# EAGLE design NinjaScanLight (EAGLE 4.16)
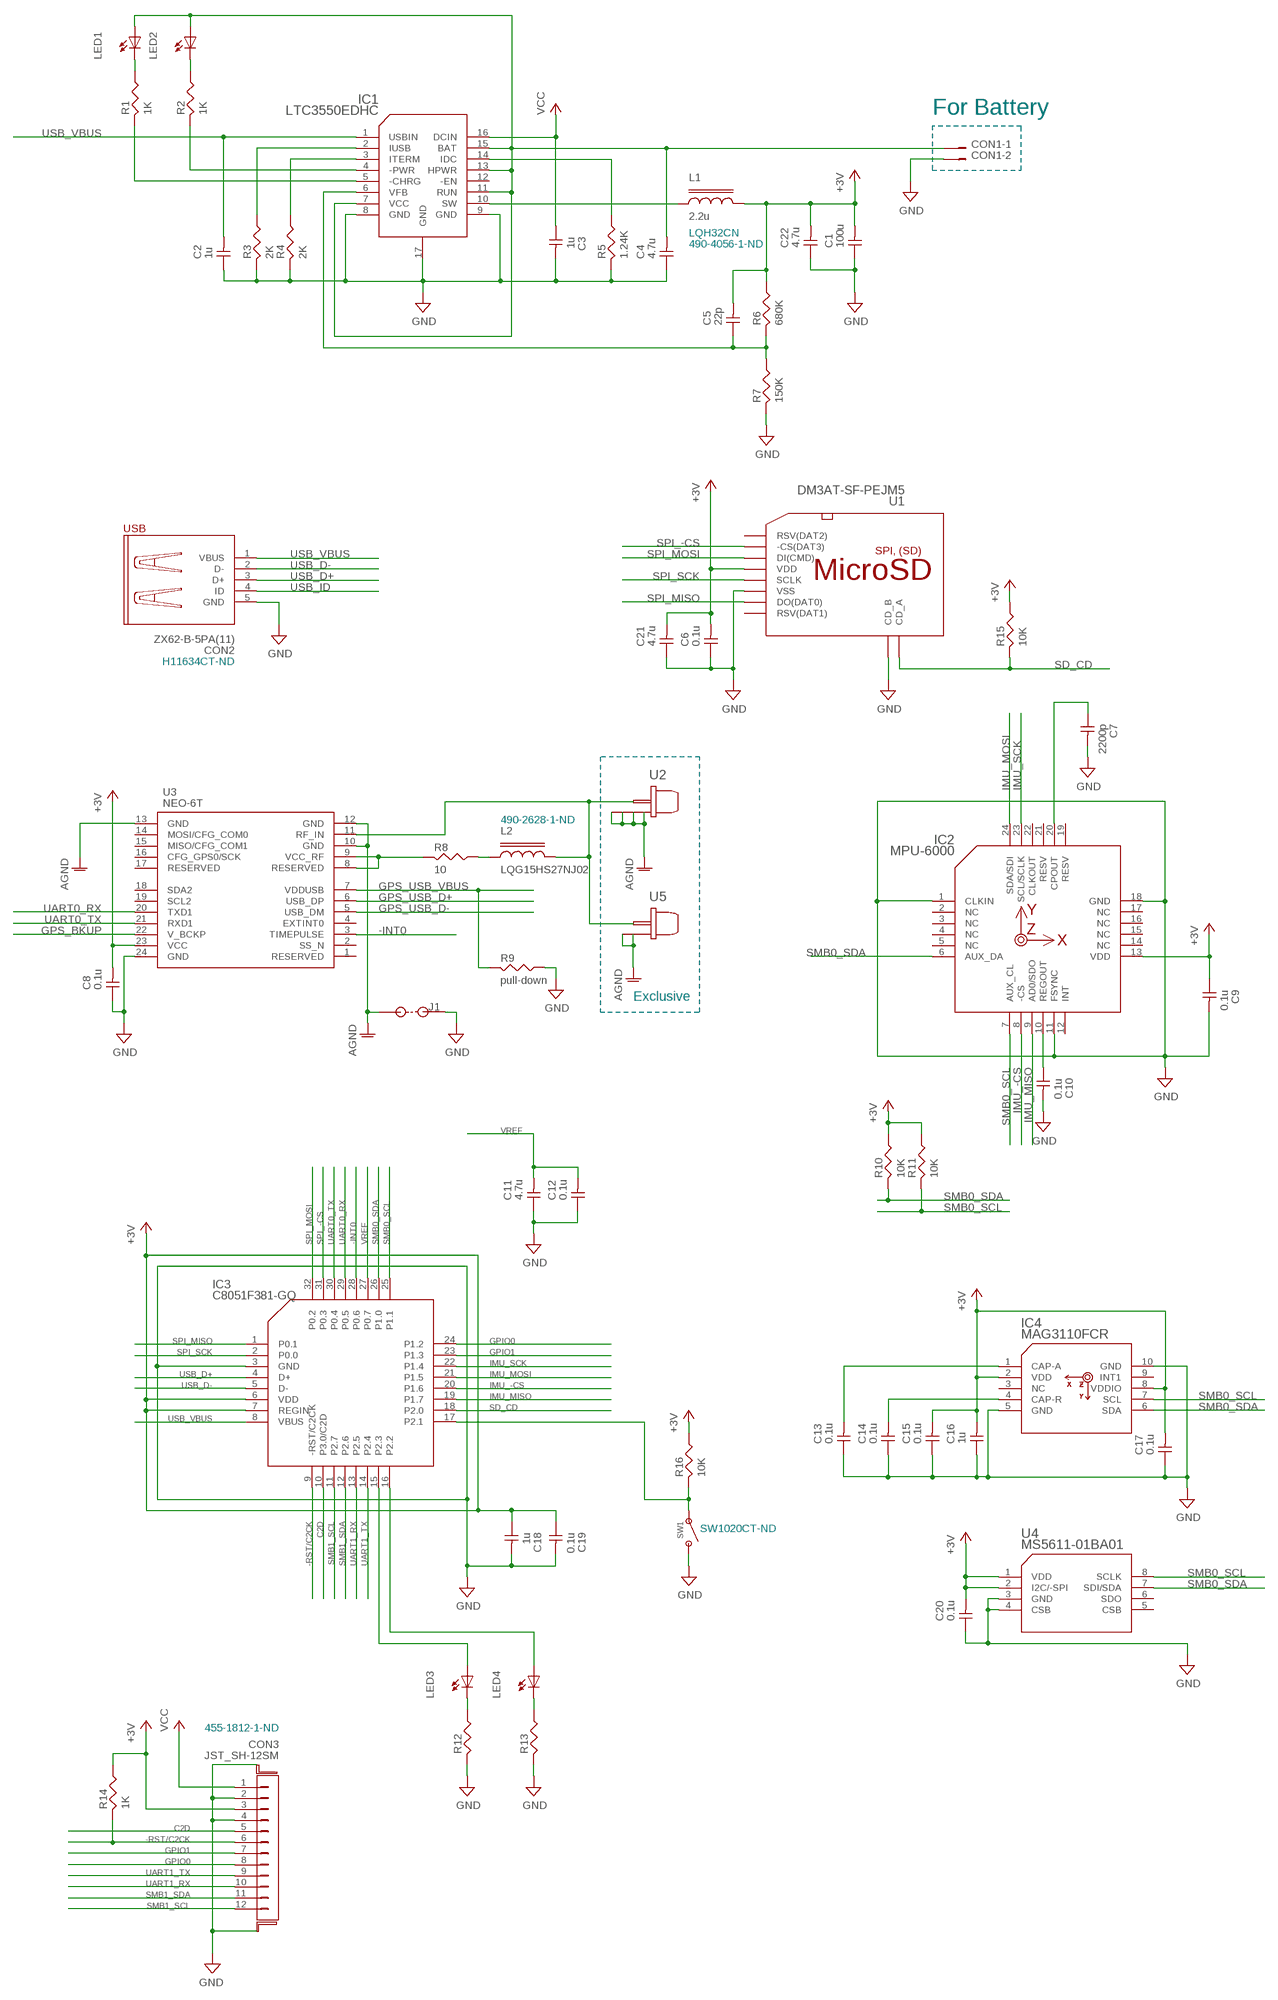
[diagram p0: schematic, sheet 1]

## Parts
C1  100u  C3216  [3216]
C2  1u  C1005  [1005]
C3  1u  C1005  [1005]
C4  4.7u  C1608  [1608]
C5  22p  C1005  [1005]
C6  0.1u  C1005  [1005]
C7  2200p  C1005  [1005]
C8  0.1u  C1005  [1005]
C9  0.1u  C1005  [1005]
C10  0.1u  C1005  [1005]
C11  4.7u  C1608  [1608]
C12  0.1u  C1005  [1005]
C13  0.1u  C1005  [1005]
C14  0.1u  C1005  [1005]
C15  0.1u  C1005  [1005]
C16  1u  C1005  [1005]
C17  0.1u  C1005  [1005]
C18  1u  C1005  [1005]
C19  0.1u  C1005  [1005]
C20  0.1u  C1005  [1005]
C21  4.7u  C1608  [1608]
C22  4.7u  C1608  [1608]
CON1  JST_ZH-2B(MM)  [JST_ZH-2B(MM)]
CON2  ZX62-B-5PA(11)  ZX62-AB-5PA  [ZX62-AB-5PA]
CON3  JST_SH-12SM  [JST_SH-SM12B]
IC1  LTC3550EDHC  [DFN16BP]
IC2  MPU-6000  [QFN24]
IC3  C8051F381-GQ  C8051F342_32  [LQFP32]
IC4  MAG3110FCR  [DFN10]
J1  JUMPER1608  [1608]
L1  2.2u  L3225  [3225]
L2  LQG15HS27NJ02  L1005  [1005]
LED1  LED1608  [1608D]
LED2  LED1608  [1608D]
LED3  LED1608  [1608D]
LED4  LED1608  [1608D]
R1  1K  R1005  [1005]
R2  1K  R1005  [1005]
R3  2K  R1005  [1005]
R4  2K  R1005  [1005]
R5  1.24K  R1005  [1005]
R6  680K  R1005  [1005]
R7  150K  R1005  [1005]
R8  10  R1005  [1005]
R9  pull-down  R1005  [1005]
R10  10K  R1005  [1005]
R11  10K  R1005  [1005]
R12  R1005  [1005]
R13  R1005  [1005]
R14  1K  R1005  [1005]
R15  10K  R1005  [1005]
R16  10K  R1005  [1005]
SW1  B3U-1000P  [B3U-1000P]
U1  DM3AT-SF-PEJM5  DM3A-SF-PEJ2  [DM3]
U2  H.FL  [H.FL]
U3  NEO-6T  [NEO]
U4  MS5611-01BA01  [LGA8]
U5  U.FL  [U.FL]

## Nets
+3V: C1.2 C5.P$2 C6.P$2 C8.P$2 C9.P$1 C15.P$2 C16.P$2 C17.P$2 C18.P$1 C19.P$1 C20.P$2 C21.P$2 C22.P$2 CON3.3 IC2.13(VDD) IC3.6(VDD) IC3.7(REGIN) IC4.2(VDD) IC4.8(VDDIO) L1.2 R6.P$1 R10.P$1 R11.P$1 R14.P$1 R15.P$1 R16.P$1 U1.4(VDD) U3.23(VCC) U4.1(VDD) U4.2(I2C/-SPI)
-INT0: IC3.28(P0.6) U3.3(TIMEPULSE)
-RST/C2CK: CON3.6 IC3.9(-RST/C2CK) R14.P$2
AGND: J1.P$1 U2.GND@1(GND) U2.GND@2(GND) U2.GND@3(GND) U3.10(GND) U3.12(GND) U3.13(GND) U5.GND@1(GND) U5.GND@2(GND)
C2D: CON3.5 IC3.10(P3.0/C2D)
GND: C1.1 C2.P$1 C3.P$2 C4.P$1 C6.P$1 C7.P$2 C8.P$1 C9.P$2 C10.P$2 C11.P$1 C12.P$1 C13.P$1 C14.P$1 C15.P$1 C16.P$1 C17.P$1 C18.P$2 C19.P$2 C20.P$1 C21.P$1 C22.P$1 CON1.2 CON2.5(GND) CON3.2 CON3.4 CON3.GUIDE@L(GUIDE) CON3.GUIDE@R(GUIDE) IC1.8(GND) IC1.9(GND) IC1.17(GND) IC2.1(CLKIN) IC2.11(FSYNC) IC2.18(GND) IC3.3(GND) IC4.5(GND) IC4.10(GND) J1.P$2 R3.P$2 R4.P$2 R5.P$2 R7.P$2 R9.P$1 R12.P$2 R13.P$2 SW1.2 U1.6(VSS) U1.CD_B U3.24(GND) U4.3(GND) U4.4(CSB)
GPIO0: CON3.8 IC3.24(P1.2)
GPIO1: CON3.7 IC3.23(P1.3)
GPS_BKUP: U3.22(V_BCKP)
GPS_USB_D+: U3.6(USB_DP)
GPS_USB_D-: U3.5(USB_DM)
GPS_USB_VBUS: R9.P$2 U3.7(VDDUSB)
IMU_-CS: IC2.8(-CS) IC3.20(P1.6)
IMU_MISO: IC2.9(AD0/SDO) IC3.19(P1.7)
IMU_MOSI: IC2.24(SDA/SDI) IC3.21(P1.5)
IMU_SCK: IC2.23(SCL/SCLK) IC3.22(P1.4)
N$1: C10.P$1 IC2.10(REGOUT)
N$2: LED3.K R12.P$1
N$3: C7.P$1 IC2.20(CPOUT)
N$4: IC3.15(P2.3) LED3.A
N$5: IC3.16(P2.2) LED4.A
N$6: L2.P$1 R8.P$1
N$7: L2.P$2 U2.SIG(C) U3.11(RF_IN) U5.SIG(C)
N$8: R8.P$2 U3.8(RESERVED) U3.9(VCC_RF)
N$9: LED1.K R1.P$1
N$10: IC3.17(P2.1) R16.P$2 SW1.1
N$11: LED2.K R2.P$1
N$12: IC1.2(IUSB) R3.P$1
N$13: IC1.3(ITERM) R4.P$1
N$14: IC1.14(IDC) R5.P$1
N$15: C5.P$1 IC1.6(VFB) R6.P$2 R7.P$1
N$16: IC1.5(-CHRG) R1.P$2
N$17: IC1.10(SW) L1.1
N$18: IC1.4(-PWR) R2.P$2
N$19: C4.P$2 CON1.1 IC1.7(VCC) IC1.11(RUN) IC1.13(HPWR) IC1.15(BAT) LED1.A LED2.A
N$20: LED4.K R13.P$1
N$22: C13.P$2 IC4.1(CAP-A)
N$29: C14.P$2 IC4.4(CAP-R)
SD_CD: IC3.18(P2.0) R15.P$2 U1.CD_A
SMB0_SCL: IC2.7(AUX_CL) IC3.25(P1.1) IC4.7(SCL) R11.P$2 U4.8(SCLK)
SMB0_SDA: IC2.6(AUX_DA) IC3.26(P1.0) IC4.6(SDA) R10.P$2 U4.7(SDI/SDA)
SMB1_SCL: CON3.12 IC3.11(P2.7)
SMB1_SDA: CON3.11 IC3.12(P2.6)
SPI_-CS: IC3.31(P0.3) U1.2(-CS(DAT3))
SPI_MISO: IC3.1(P0.1) U1.7(DO(DAT0))
SPI_MOSI: IC3.32(P0.2) U1.3(DI(CMD))
SPI_SCK: IC3.2(P0.0) U1.5(SCLK)
UART0_RX: IC3.29(P0.5) U3.20(TXD1)
UART0_TX: IC3.30(P0.4) U3.21(RXD1)
UART1_RX: CON3.10 IC3.13(P2.5)
UART1_TX: CON3.9 IC3.14(P2.4)
USB_D+: CON2.3(D+) IC3.4(D+)
USB_D-: CON2.2(D-) IC3.5(D-)
USB_ID: CON2.4(ID)
USB_VBUS: C2.P$2 CON2.1(VBUS) IC1.1(USBIN) IC3.8(VBUS)
VCC: C3.P$1 CON3.1 IC1.16(DCIN)
VREF: C11.P$2 C12.P$2 IC3.27(P0.7)
Unconnected: IC1.12(-EN) IC2.2(NC) IC2.3(NC) IC2.4(NC) IC2.5(NC) IC2.12(INT) IC2.14(NC) IC2.15(NC) IC2.16(NC) IC2.17(NC) IC2.19(RESV) IC2.21(RESV) IC2.22(CLKOUT) IC4.3(NC) IC4.9(INT1) U1.1(RSV(DAT2)) U1.8(RSV(DAT1)) U3.1(RESERVED) U3.2(SS_N) U3.4(EXTINT0) U3.14(MOSI/CFG_COM0) U3.15(MISO/CFG_COM1) U3.16(CFG_GPS0/SCK) U3.17(RESERVED) U3.18(SDA2) U3.19(SCL2) U4.5(CSB) U4.6(SDO)

## Notes on the sheet
- For Battery
- LQH32CN
- 490-4056-1-ND
- H11634CT-ND
- 490-2628-1-ND
- Exclusive
- SW1020CT-ND
- 455-1812-1-ND

## Power pins joined to a net without a drawn wire
GND: CON2.GUIDE@L1(GND) CON2.GUIDE@L3(GND) CON2.GUIDE@R1(GND) CON2.GUIDE@R3(GND) U1.GND@1(GND) U1.GND@2(GND) U1.GND@3(GND) U1.GND@4(GND)

## Library data of the parts
C1-C22 = additional:C: Capacitor (Non-Polar)
CON1 = additional:JST_ZH-2*: JST_ZH-2 1.5mm pitch 2-pins Connector.
CON2 = additional:ZX62-AB-5PA: USB Micro-AB Connector
CON3 = additional:JST_SH-12*: JST SH-12pins
IC1 = main:LTC3550: LTC3550 Dual Input USB/AC Adapter Li-Ion Battery Charger with 600mA Buck Converter
IC2 = sensor:MPU-6000: MPU-6000 Motion Processing Unit, 6 + 3 DOF inertial sensor unit
IC3 = main:C8051F34*_32: C8051F342/3/6/7 Full Speed USB Flash MCU 32 pins
IC4 = main:MAG3110: MAG3110 Three-Axis, Digital Magnetometer
J1 = additional:JUMPER: Jumper
L1 L2 = additional:L: Inductor
LED1-LED4 = additional:LED: Light Emitting Diode
R1-R16 = additional:R: Resistance
SW1 = additional:B3U-*: B3U Ultra-small-sized Tactile Switch with High Contact Reliability: 1.2 x 3 x 2.5 mm (H x W x D)
U1 = additional:DM3*-SF-PEJ: DM3*-SF-PEJ MicroSD socket.
U2 = gps:H.FL: Hirose H.FL SMT low profile coaxicial connector
U3 = gps:NEO-6*: NEO-6 u-blox 6 GPS Modules
U4 = sensor:MS5611-01BA*: MS5611-01BA01 Barometric Pressure Sensor, with LCP(01) / metal(03) cap
U5 = gps:U.FL: Hirose U.FL SMT low profile coaxicial connector

## Board
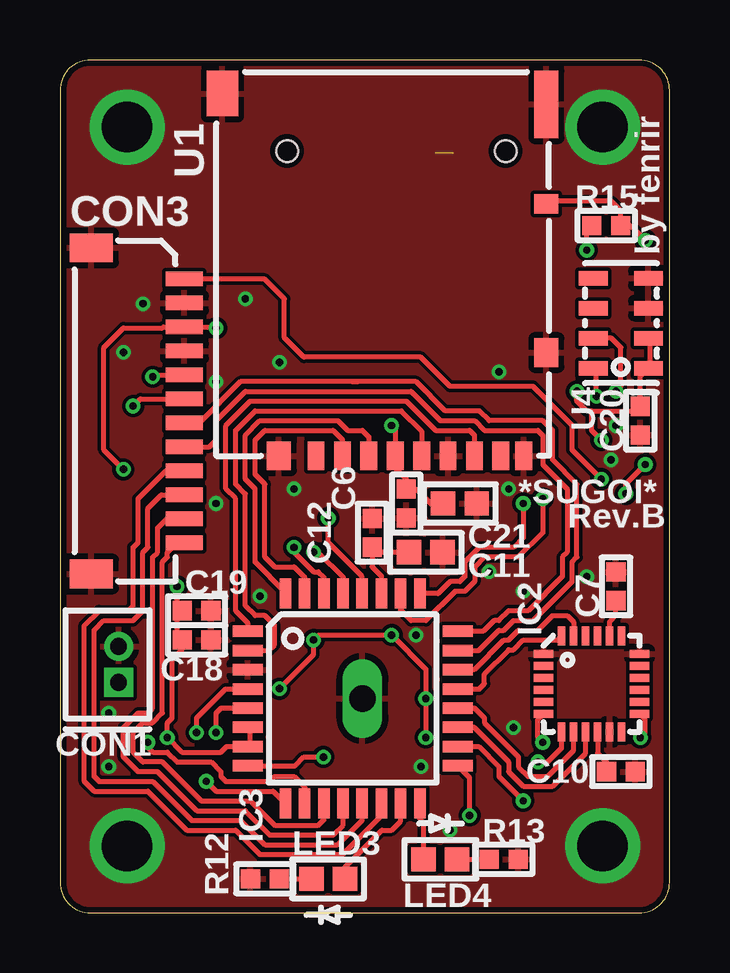
[diagram p1: board, top side]
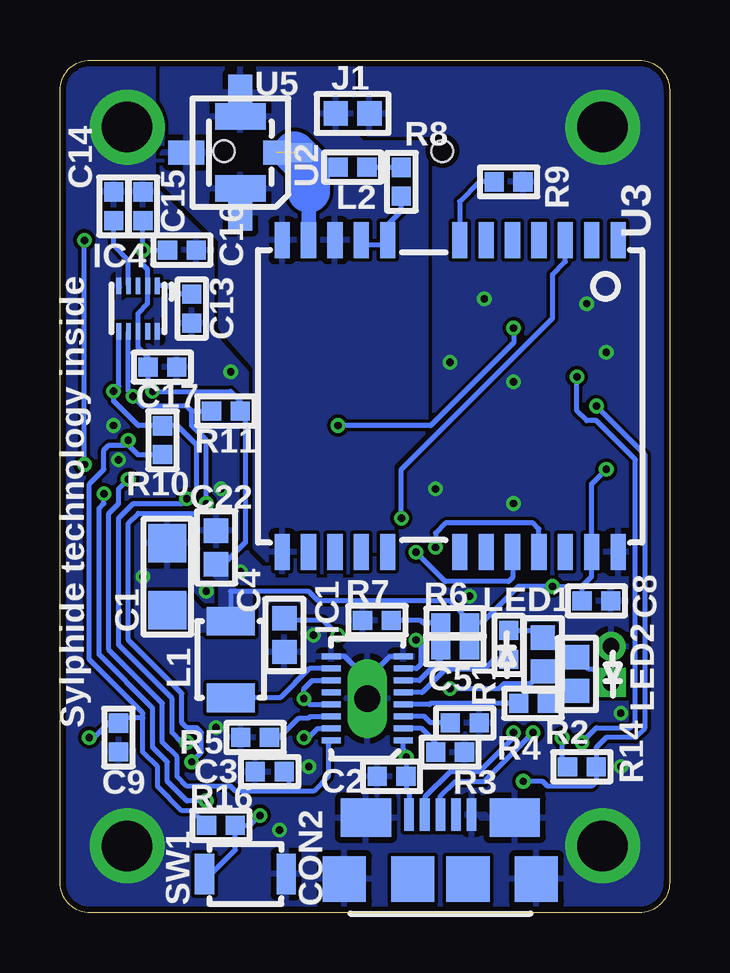
[diagram p2: board, bottom side, seen from below]

Size 25.4 x 35.56 mm. Coordinates in mm from the lower left corner, seen from the top.
Outline: 24.13,0 arc90 25.4,1.27 25.4,34.29 arc90 24.13,35.56 1.27,35.56 arc90 0,34.29 0,1.27 arc90 1.27,0 24.13,0
Copper layers (1*16): Top 0.035mm / dielectric 1.5mm / Bottom 0.035mm
Design rules "Fusion_eagle_rule_v1.1": minimum track width 6mil, minimum drill 12mil, track to track 6mil, track to pad 6mil, pad to pad 6mil, via to via 6mil, smd to smd 0mil, copper to edge 10mil, drill to drill 10mil, minimum pad ring 10mil, minimum via ring 6mil, stop-mask expansion 2mil, vias tented up to drill 100mil, thermal gap 10mil

### Footprints (pad centres in the part's own frame; a part is rotated, then mirrored left to right if it is on the bottom)
3216 = smd 1.6 x 1.6: 1 -1.4,0; 2 1.4,0
1005 = smd 0.8 x 0.8: P$1 -0.6,0; P$2 0.6,0
1608 = smd 1.016 x 1.016: P$1 -0.7,0; P$2 0.7,0
JST_ZH-2B(MM) = drill 0.7 pad 1.118 square: 1 -0.75,0 | drill 0.7 pad 1.118 round: 2 0.75,0
ZX62-AB-5PA = smd 0.4 x 1.35: 1 -1.3,2.675; 2 -0.65,2.675; 3 0,2.675; 4 0.65,2.675; 5 1.3,2.675 | smd 2.1 x 1.6: GUIDE@L1 -3.1,2.55; GUIDE@R1 3.1,2.55 | smd 1.8 x 1.9: GUIDE@L2 -1.15,0; GUIDE@L3 -4,0; GUIDE@R2 1.15,0; GUIDE@R3 4,0
JST_SH-SM12B = smd 0.6 x 1.55: 1 -5.5,4.775; 2 -4.5,4.775; 3 -3.5,4.775; 4 -2.5,4.775; 5 -1.5,4.775; 6 -0.5,4.775; 7 0.5,4.775; 8 1.5,4.775; 9 2.5,4.775; 10 3.5,4.775; 11 4.5,4.775; 12 5.5,4.775 | smd 1.2 x 1.8: GUIDE@L -6.8,0.9; GUIDE@R 6.8,0.9
DFN16BP = smd 0.25 x 0.8: 1 -1.75,-1.5; 2 -1.25,-1.5; 3 -0.75,-1.5; 4 -0.25,-1.5; 5 0.25,-1.5; 6 0.75,-1.5; 7 1.25,-1.5; 8 1.75,-1.5; 9 1.75,1.5; 10 1.25,1.5; 11 0.75,1.5; 12 0.25,1.5; 13 -0.25,1.5; 14 -0.75,1.5; 15 -1.25,1.5; 16 -1.75,1.5 | drill 1.1 pad 1.4 long: 17 0,0
QFN24 = smd 0.8 x 0.32: 1 -2,1.25; 2 -2,0.75; 3 -2,0.25; 4 -2,-0.25; 5 -2,-0.75; 6 -2,-1.25; 13 2,-1.25; 14 2,-0.75; 15 2,-0.25; 16 2,0.25; 17 2,0.75; 18 2,1.25 | smd 0.32 x 0.8: 7 -1.25,-2; 8 -0.75,-2; 9 -0.25,-2; 10 0.25,-2; 11 0.75,-2; 12 1.25,-2; 19 1.25,2; 20 0.75,2; 21 0.25,2; 22 -0.25,2; 23 -0.75,2; 24 -1.25,2
LQFP32 = smd 0.48 x 1.25: 1 -2.8,-4.375; 2 -2,-4.375; 3 -1.2,-4.375; 4 -0.4,-4.375; 5 0.4,-4.375; 6 1.2,-4.375; 7 2,-4.375; 8 2.8,-4.375; 17 2.8,4.375; 18 2,4.375; 19 1.2,4.375; 20 0.4,4.375; 21 -0.4,4.375; 22 -1.2,4.375; 23 -2,4.375; 24 -2.8,4.375 | smd 1.25 x 0.48: 9 4.375,-2.8; 10 4.375,-2; 11 4.375,-1.2; 12 4.375,-0.4; 13 4.375,0.4; 14 4.375,1.2; 15 4.375,2; 16 4.375,2.8; 25 -4.375,2.8; 26 -4.375,2; 27 -4.375,1.2; 28 -4.375,0.4; 29 -4.375,-0.4; 30 -4.375,-1.2; 31 -4.375,-2; 32 -4.375,-2.8
DFN10 = smd 0.7 x 0.2: 1 -0.95,0.8; 2 -0.95,0.4; 3 -0.95,0; 4 -0.95,-0.4; 5 -0.95,-0.8; 6 0.95,-0.8; 7 0.95,-0.4; 8 0.95,0; 9 0.95,0.4; 10 0.95,0.8
3225 = smd 1.2 x 2: 1 -1.6,0; 2 1.6,0
1608D = smd 1.016 x 1.016: A -0.7,0; K 0.7,0
B3U-1000P = smd 0.8 x 1.7: 1 -1.7,0; 2 1.7,0
DM3 = smd 0.7 x 1.2: 1 0,0.6; 2 -1.1,0.6; 3 -2.2,0.6; 4 -3.3,0.6; 5 -4.4,0.6; 6 -5.5,0.6; 7 -6.6,0.6; 8 -7.7,0.6; GND@1 -8.65,0.6 | smd 1 x 0.8: CD_A -9.6,-9.9 | smd 1 x 1.2: CD_B -9.6,-3.7; GND@2 1.55,0.6 | smd 1.3 x 1.9: GND@3 3.9,-14.5 | smd 1 x 2.8: GND@4 -9.6,-14.05 | hole 0.889: 1.2,-12.1; -7.9,-12.1
H.FL = smd 1.5 x 1: GND@1 2.5,0; GND@3 -2.5,0 | smd 1 x 1.5: GND@2 0,2.25 | smd 0.8 x 1.5: SIG 0,-2.25
NEO = smd 1.5 x 0.635: 1 6.5,-7; 2 6.5,-5.9; 3 6.5,-4.8; 4 6.5,-3.7; 5 6.5,-2.6; 6 6.5,-1.5; 7 6.5,-0.4; 8 6.5,2.6; 9 6.5,3.7; 10 6.5,4.8; 11 6.5,5.9; 12 6.5,7; 13 -6.5,7; 14 -6.5,5.9; 15 -6.5,4.8; 16 -6.5,3.7; 17 -6.5,2.6; 18 -6.5,-0.4; 19 -6.5,-1.5; 20 -6.5,-2.6; 21 -6.5,-3.7; 22 -6.5,-4.8; 23 -6.5,-5.9; 24 -6.5,-7
LGA8 = smd 1.2 x 0.6: 1 -1.15,1.875; 2 -1.15,0.625; 3 -1.15,-0.625; 4 -1.15,-1.875; 5 1.15,-1.875; 6 1.15,-0.625; 7 1.15,0.625; 8 1.15,1.875
U.FL = smd 1.1 x 2.1: GND@1 -1.5,0; GND@2 1.5,0 | smd 1 x 1.1: SIG 0,-1.5

### Placement (x,y rotation side)
C1  20.93,14.02 270 bottom
C2  11.58,5.69 0 bottom
C3  16.66,5.89 180 bottom
C4  16.05,11.58 90 bottom
C5  8.94,10.97 0 bottom
C6  14.43,17.07 90 top
C7  23.16,13.61 90 top
C8  3.05,13 180 bottom
C9  22.96,7.32 270 bottom
C10  23.37,5.89 0 top
C11  15.24,15.04 180 top
C12  13,15.85 270 top
C13  19.91,25.2 90 bottom
C14  23.16,29.46 270 bottom
C15  21.95,29.46 270 bottom
C16  20.32,27.64 180 bottom
C17  21.13,22.76 180 bottom
C18  5.69,11.38 0 top
C19  5.69,12.6 0 top
C20  24.18,20.52 90 top
C21  16.66,17.07 180 top
C22  18.9,15.24 270 bottom
CON1  2.44,10.36 90 top
CON2  9.55,1.42 0 bottom
CON3  0.41,20.93 270 top
IC1  12.6,8.94 90 bottom
IC2  22.15,9.55 0 top
IC3  12.19,8.94 270 top
IC4  22.15,25.2 270 bottom
J1  13.21,33.32 0 bottom
L1  18.29,10.57 90 bottom
L2  13.21,31.09 180 bottom
LED1  5.28,10.77 90 bottom
LED2  3.86,9.96 270 bottom
LED3  11.18,1.42 180 top
LED4  15.85,2.24 0 top
R1  6.71,11.18 270 bottom
R2  5.69,8.74 180 bottom
R3  9.14,6.71 0 bottom
R4  8.53,7.92 0 bottom
R5  17.27,7.32 180 bottom
R6  8.94,12.09 180 bottom
R7  12.19,12.19 180 bottom
R8  11.18,30.48 270 bottom
R9  6.71,30.48 180 bottom
R10  21.13,19.71 90 bottom
R11  18.49,20.93 180 bottom
R12  8.53,1.42 180 top
R13  18.49,2.24 0 top
R14  3.66,6.1 0 bottom
R15  22.76,28.65 0 top
R16  18.69,3.66 0 bottom
SW1  17.68,1.63 0 bottom
U1  10.67,19.66 180 top
U2  17.88,31.7 90 bottom
U3  9.14,21.54 90 bottom
U4  23.37,24.59 180 top
U5  17.88,31.7 90 bottom

### Tracks (layer width: path | path; a pad name or v marks a point on that pad's centre or on a via)
+3V  (via drill 0.3)
  Top 0.203: 22.15,20.93 21.95,20.93 21.54,21.34 v21.54,21.74 | v22.55,19.71 22.15,20.12 22.15,20.93 | U4.2 24.59,23.89 24.59,22.78 U4.1 24.18,22.38 C20.P$2 23.99,20.93 22.15,20.93 | IC3.6 7.92,7.63 7.92,7.05 IC3.7 6.94,6.94 6.71,6.71 5.08,6.71 v4.47,7.32 4.47,7.92 4.67,8.13 4.67,10.57 5.09,10.98 C18.P$1 4.88,11.59 4.88,12.39 C19.P$1 4.88,12.81 v4.88,13.61 | v2.64,18.49 1.83,19.3 1.83,23.57 2.64,24.38 4.27,24.38 4.31,24.43 CON3.3 6.46,24.43 v6.5,24.38 | v13.82,20.32 13.97,20.17 U1.4 13.97,18.54 14.43,18.09 C6.P$2 14.84,17.67 15.44,17.07 C21.P$2 | R15.P$1 21.95,28.44 v21.95,27.64 | v24.18,7.32 24.38,7.52 24.38,8.06 IC2.13
  Bottom 0.2: IC4.2 21.75,25.39 22.15,24.99 IC4.8 22.15,23.57
  Bottom 0.203: C5.P$2 8.13,11.19 8.13,11.88 R6.P$1 | R6.P$1 7.82,12.09 6.3,13.61 v4.88,13.61 3.66,13.61 | 3.66,13.61 3.24,14.03 U3.23 3.24,17.89 v2.64,18.49 | C8.P$2 3.66,13.01 3.66,13.61 | 22.15,23.57 21.73,23.16 C17.P$2 21.73,21.94 v21.54,21.74 18.29,21.74 17.89,21.35 R11.P$1 17.68,20.72 17.68,15.44 18.58,14.54 C22.P$2 | R6.P$1 8.34,12.2 9.14,13.01 14.63,13.01 15.04,13.41 18.29,13.41 L1.2 | C1.2 20.75,12.8 | v6.5,24.38 6.5,23.77 9.96,20.32 v13.82,20.32 | R14.P$1 4.47,6.31 v4.47,7.32 | IC4.2 21.75,26.83 21.95,27.03 v21.95,27.64 | v21.95,27.64 C15.P$2 | v21.95,27.64 C16.P$2 | R10.P$1 22.16,19.11 22.55,19.51 | 22.55,19.51 v22.55,19.71 | 22.55,19.51 23.37,19.51 23.57,19.3 23.57,18.49 24.18,17.88 24.18,10.57 21.95,8.33 21.95,8.13 | 21.95,8.13 21.95,6.71 21.34,6.1 21.34,5.28 20.32,4.27 19.91,4.27 19.29,3.65 R16.P$1 | v24.18,7.32 23.98,7.32 23.38,7.92 C9.P$1 22.75,8.13 21.95,8.13
  pour Bottom (no thermals): 17.48,11.79 19.91,11.79 20.12,11.99 21.54,11.99 21.54,13.21 20.12,13.21 19.51,12.6 18.69,12.6 18.69,13.82 19.3,14.43 19.3,14.83 18.49,14.83 18.49,13.82 18.08,13.41 17.48,13.41
-INT0  (via drill 0.3)
  Top 0.203: IC3.28 12.59,14.03 11.18,15.44 v11.18,16.46
  Bottom 0.203: v11.18,16.46 11.18,18.49 4.88,24.79 4.88,26.62 4.34,27.15 U3.3
-RST/C2CK  (via drill 0.3)
  Top 0.203: CON3.6 3.35,21.43 v3.05,21.13 | IC3.9 8.88,5.08 6.5,5.08 v6.1,5.49
  Bottom 0.203: v3.05,21.13 1.02,19.1 1.02,7.72 1.42,7.32 2.64,7.32 3.06,6.9 R14.P$2 3.06,5.48 3.25,5.28 5.08,5.28 5.28,5.49 v6.1,5.49
AGND
  pour Bottom: 13.21,35.56 13.21,32.51 12.8,32.11 10.16,32.11 10.16,20.12 11.58,18.69 11.58,15.85 13.21,14.22 16.26,14.22 17.27,15.24 17.27,22.76 18.69,24.38 18.69,28.04 21.13,30.48 21.13,35.56
C2D  (via drill 0.3)
  Top 0.203: CON3.5 3.94,22.43 v3.86,22.35 | v3.66,7.11 3.66,6.91 3.86,6.71 4.47,6.71 4.88,6.3 6.3,6.3 6.71,5.89 6.71,5.69 6.91,5.49 8.74,5.49 8.94,5.69 9.75,5.69 10.19,5.25 IC3.10
  Bottom 0.203: v3.66,7.11 3.05,7.72 1.63,7.72 1.42,7.92 1.42,18.9 3.05,20.52 3.45,20.52 3.86,20.93 v3.86,22.35
GND  (via drill 0.3, 2.11)
  Bottom 0.203: IC1.8 11.66,10.69 12.6,9.75 | IC1.17 12.6,9.75 | IC1.9 13.54,10.69 12.6,9.75
  other vias: 2.79,2.79 22.61,2.79 22.61,32.77 2.79,32.77 9.75,17.68 8.33,13.21 18.29,22.56 16.26,3.45 9.14,22.96 19.3,13.41 7.72,25.6 6.5,22.15 22.96,18.9 2.64,23.37 15.04,6.1 6.5,17.07 2.03,8.33 17.88,14.22 18.9,7.72 18.69,17.68 21.95,14.02 3.45,25.4 2.03,6.1 23.16,20.32 14.83,11.58
  pour Top (rank 2): 0,35.56 0,0 25.4,0 25.4,35.56
  pour Bottom (rank 2): 0,35.56 25.4,35.56 25.4,0 0,0
  pour Bottom: 20.93,26.82 23.37,26.82 23.37,23.57 20.93,23.57
GPIO0
  Top 0.203: CON3.8 6.22,19.43 6.5,19.71 6.5,20.52 7.72,21.74 14.63,21.74 15.85,20.52 17.27,20.52 17.68,20.12 19.91,20.12 20.12,19.91 20.12,18.69 21.13,17.68 21.13,15.04 20.93,14.83 20.93,14.02 19.51,12.6 18.69,12.6 18.29,12.19 18.09,12.19 17.63,11.74 IC3.24
GPIO1
  Top 0.203: CON3.7 5.8,20.43 7.52,22.15 12.19,22.15 | 12.19,22.15 12.39,22.15 | 12.19,22.15 14.83,22.15 16.05,20.93 17.48,20.93 17.88,20.52 20.12,20.52 20.52,20.12 20.52,18.9 21.54,17.88 21.54,14.83 21.34,14.63 21.34,13.82 19.71,12.19 18.9,12.19 18.49,11.79 18.29,11.79 17.44,10.94 IC3.23
GPS_USB_VBUS
  Bottom 0.203: U3.7 8.74,29.66 7.92,30.48 R9.P$2
IMU_-CS
  Top 0.203: IC3.20 17.27,8.54 17.68,8.13 17.68,7.92 19.1,6.5 19.1,6.1 19.51,5.69 20.32,5.69 21.4,6.77 IC2.8
IMU_MISO
  Top 0.203: IC3.19 17.25,7.74 18.69,6.3 18.69,5.89 19.3,5.28 20.52,5.28 21.9,6.66 IC2.9
IMU_MOSI
  Top 0.203: IC3.21 17.47,9.34 17.68,9.55 17.68,9.96 18.69,10.97 18.9,10.97 19.3,11.38 20.73,11.38 IC2.24
IMU_SCK
  Top 0.203: IC3.22 16.59,10.16 17.27,10.16 18.49,11.38 18.69,11.38 19.1,11.79 19.91,11.79 20.52,12.39 21.13,12.39 21.4,12.13 IC2.23
N$1
  Top 0.203: IC2.10 22.4,6.66 22.77,6.29 C10.P$1
N$2
  Top 0.203: R12.P$1 LED3.K
N$3
  Top 0.203: IC2.20 22.9,12.13 23.16,12.39 C7.P$1
N$4
  Top 0.203: LED3.A 11.88,1.92 13.41,3.45 13.82,3.45 14.19,3.83 IC3.15
N$5
  Top 0.203: LED4.A 15.15,3.75 14.99,3.91 IC3.16
N$6
  Bottom 0.203: R8.P$1 L2.P$1
N$7  (1 unrouted)
  Bottom 0.61: U3.11 15.04,30.07 | 15.04,31.09 L2.P$2
  Bottom 1.778: U2.SIG 15.04,31.1 15.04,31.09 15.04,30.07
N$8
  Bottom 0.203: U3.9 12.64,27.84 11.95,27.84 U3.8 11.74,28.69 11.18,29.26 R8.P$2
N$9
  Bottom 0.203: LED1.K 5.6,11.79 6.7,11.79 R1.P$1
N$10  (via drill 0.3)
  Top 0.203: IC3.17 17.07,5.64 v17.07,4.06
  Bottom 0.203: SW1.1 19.1,1.63 18.09,2.63 R16.P$2 17.48,3.66 v17.07,4.06
N$11
  Bottom 0.203: LED2.K 3.97,9.14 4.88,9.14 5.09,8.93 R2.P$1
N$12
  Bottom 0.203: IC1.2 10.33,7.69 9.74,7.1 R3.P$1
N$13
  Bottom 0.203: R4.P$1 9.96,7.92 10.22,8.19 IC1.3
N$14
  Bottom 0.203: IC1.14 14.97,8.19 15.04,8.13 15.44,8.13 16.26,7.32 R5.P$1
N$15
  Bottom 0.203: IC1.6 10.43,9.69 9.55,10.57 C5.P$1 9.75,11.19 9.75,11.88 R6.P$2 10.26,12.09 10.36,12.19 R7.P$1
N$16
  Bottom 0.203: IC1.5 10.32,9.19 9.35,10.16 7.72,10.16 7.31,10.58 R1.P$2
N$17
  Bottom 0.203: IC1.10 15.01,10.19 16.23,8.97 L1.1
N$18
  Bottom 0.203: IC1.4 10,8.69 9.96,8.74 R2.P$2
N$19  (via drill 0.3)
  Top 0.203: v15.24,7.32 v15.24,8.94 15.24,10.16 v13.82,11.58 10.77,11.58 v10.57,11.38 10.57,10.77 v9.14,9.35
  Bottom 0.203: IC1.15 14.66,7.69 15.04,7.32 v15.24,7.32 | IC1.11 14.9,9.69 15.24,9.35 v15.24,8.94 14.99,8.69 IC1.13 | IC1.7 10.54,10.19 10.36,10.36 10.36,11.18 v10.57,11.38 | v9.14,9.35 7.11,9.35 6.91,9.55 5.8,9.55 LED1.A 4.97,10.07 4.47,10.57 3.95,10.57 LED2.A 3.36,10.16 2.98,10.16 CON1.1 | v13.82,11.58 14.43,12.19 15.96,12.19 C4.P$2
N$20
  Top 0.203: LED4.K R13.P$1
N$22
  Bottom 0.2: 20.86,26.15 IC4.1
  Bottom 0.203: C13.P$2 20.51,25.8 20.86,26.15
N$29
  Bottom 0.203: IC4.4 22.55,27.22 23.16,27.84 C14.P$2
SD_CD  (via drill 0.3)
  Top 0.203: IC3.18 17.44,6.94 18.29,6.1 18.29,5.69 v19.3,4.67 | v24.38,28.04 23.77,28.65 R15.P$2 23.36,29.27 22.96,29.67 20.38,29.67 U1.CD_A | v24.38,18.69 23.57,17.88 v23.57,17.48
  Bottom 0.203: v24.38,18.69 v24.38,28.04 | v23.57,17.48 23.57,17.07 23.77,16.87 23.77,10.77 21.54,8.53 21.54,6.91 20.93,6.3 20.93,5.49 20.12,4.67 v19.3,4.67
SMB0_SCL  (via drill 0.3)
  Top 0.203: U4.8 22.35,22.58 v22.35,21.54 | IC3.25 15.75,13.32 16.26,13.82 16.66,13.82 16.87,14.02 16.87,14.63 17.48,15.24 18.9,15.24 19.3,15.65 v19.3,17.07 | IC2.7 20.9,6.88 20.32,6.3 v19.91,6.3
  Bottom 0.2: 22.55,21.74 IC4.7
  Bottom 0.203: 19.91,20.93 19.91,20.32 19.3,19.71 v19.3,17.07 19.71,16.66 22.15,16.66 22.55,16.26 22.55,11.38 20.32,9.14 20.32,7.92 20.12,7.72 19.71,7.72 19.51,7.52 19.51,6.71 v19.91,6.3 | 19.91,20.93 R11.P$2 | 19.91,20.93 20.12,21.13 21.95,21.13 v22.35,21.54 22.55,21.74
SMB0_SDA  (via drill 0.3)
  Top 0.203: U4.7 22.98,23.96 23.37,23.57 23.37,21.95 v23.16,21.74 | IC3.26 14.19,12.63 14.63,12.19 15.24,12.19 16.46,13.41 16.87,13.41 17.27,13.82 17.27,14.43 17.68,14.83 19.1,14.83 20.12,15.85 v20.12,17.27 | v20.12,7.11 19.91,7.32 19.91,8.06 IC2.6
  Bottom 0.2: IC4.6 22.95,21.96 v23.16,21.74
  Bottom 0.203: v23.16,21.74 23.16,21.34 22.14,20.31 R10.P$2 20.51,20.31 19.71,19.51 19.71,17.68 v20.12,17.27 20.32,17.07 22.35,17.07 22.96,16.46 22.96,11.18 20.73,8.94 20.73,7.52 20.32,7.11 v20.12,7.11
SMB1_SCL
  Top 0.203: IC3.11 10.99,3.88 10.77,3.66 8.94,3.66 7.92,4.67 5.89,4.67 4.27,6.3 3.45,6.3 3.05,6.71 3.05,7.52 3.45,7.92 3.86,7.92 4.27,8.33 4.27,14.63 4.47,14.83 4.47,15.04 4.86,15.43 CON3.12
SMB1_SDA
  Top 0.203: CON3.11 4.44,16.43 4.06,16.05 4.06,15.04 3.86,14.83 3.86,8.53 3.66,8.33 3.25,8.33 2.64,7.72 2.64,6.5 3.25,5.89 4.06,5.89 5.69,4.27 7.72,4.27 8.74,3.25 11.38,3.25 11.79,3.66 IC3.12
SPI_-CS
  Top 0.203: U1.2 11.77,19.73 11.38,20.12 8.53,20.12 8.13,19.71 8.13,18.29 8.53,17.88 8.53,14.83 8.94,14.43 9.75,14.43 10.19,13.99 IC3.31
SPI_MISO
  Top 0.203: U1.7 17.27,19.92 17.07,20.12 15.65,20.12 14.43,21.34 7.92,21.34 6.91,20.32 6.91,17.68 7.32,17.27 7.32,12.6 7.82,12.1 IC3.1
SPI_MOSI
  Top 0.203: U1.3 12.87,19.85 12.6,20.12 11.99,20.12 11.58,20.52 8.33,20.52 7.72,19.91 7.72,18.09 8.13,17.68 8.13,14.63 9.39,13.37 IC3.32
SPI_SCK
  Top 0.203: U1.5 15.07,20.09 14.22,20.93 8.13,20.93 7.32,20.12 7.32,17.88 7.72,17.48 7.72,12.8 8.13,12.39 8.53,12.39 8.94,11.99 8.94,11.18 8.71,10.94 IC3.2
UART0_RX  (via drill 0.3)
  Top 0.203: v10.57,15.04 10.77,15.04 11.79,14.01 IC3.29
  Bottom 0.203: U3.20 6.54,13.98 6.71,13.82 9.35,13.82 v10.57,15.04
UART0_TX  (via drill 0.3)
  Top 0.203: IC3.30 10.99,14 10.77,14.22 10.57,14.22 9.75,15.04 v9.75,15.24
  Bottom 0.203: U3.21 5.44,16.01 5.69,16.26 9.35,16.26 9.75,15.85 v9.75,15.24
UART1_RX
  Top 0.203: CON3.10 4.22,17.43 3.66,16.87 3.66,15.24 3.45,15.04 3.45,12.6 3.05,12.19 1.83,12.19 1.42,11.79 1.42,5.69 1.63,5.49 3.86,5.49 5.49,3.86 7.52,3.86 8.53,2.85 11.58,2.85 12.59,3.85 IC3.13
UART1_TX
  Top 0.203: CON3.9 4.41,18.43 3.25,17.27 3.25,15.44 3.05,15.24 3.05,12.8 2.85,12.6 1.63,12.6 1.02,11.99 1.02,5.49 1.42,5.08 3.66,5.08 5.28,3.45 7.32,3.45 8.33,2.44 11.79,2.44 13.39,4.04 IC3.14
USB_D+  (via drill 0.3)
  Top 0.203: IC3.4 6.9,9.34 5.69,8.13 v5.69,7.52
  Bottom 0.203: v5.69,7.52 7.72,5.49 8.94,5.49 9.55,4.88 CON2.3
USB_D-  (via drill 0.3)
  Top 0.203: v6.5,7.52 6.5,8.33 6.71,8.54 IC3.5
  Bottom 0.203: v6.5,7.52 6.5,7.32 7.92,5.89 9.14,5.89 10.2,4.84 CON2.2
USB_VBUS  (via drill 0.3)
  Top 0.203: IC3.8 9.8,6.14 10.16,6.5 v10.97,6.5
  Bottom 0.203: CON2.1 10.85,4.96 10.98,5.09 C2.P$2 v10.97,6.5 10.97,6.71 11.1,6.83 IC1.1
VCC  (via drill 0.3)
  Top 0.203: v22.55,18.09 21.34,19.3 21.34,20.32 19.71,21.95 16.26,21.95 15.04,23.16 10.16,23.16 9.35,23.98 9.35,25.6 8.53,26.42 5.17,26.42 CON3.1
  Bottom 0.203: 15.85,5.08 14.83,5.08 14.22,5.69 14.22,7.07 IC1.16 | 15.85,5.08 18.09,5.08 18.29,5.28 20.12,5.28 20.52,5.69 20.52,6.5 21.13,7.11 21.13,8.74 23.37,10.97 23.37,16.66 22.96,17.07 22.96,17.68 v22.55,18.09 | C3.P$1 15.85,5.68 15.85,5.08
VREF
  Top 0.203: IC3.27 13.39,14.04 13.01,14.43 C12.P$2 13.22,15.04 C11.P$2

### Text on the board
tNames: by fenrir | *SUGOI* | Rev.B
bNames: Sylphide technology inside